# Altium project Lab 1 - Test.PrjPcb
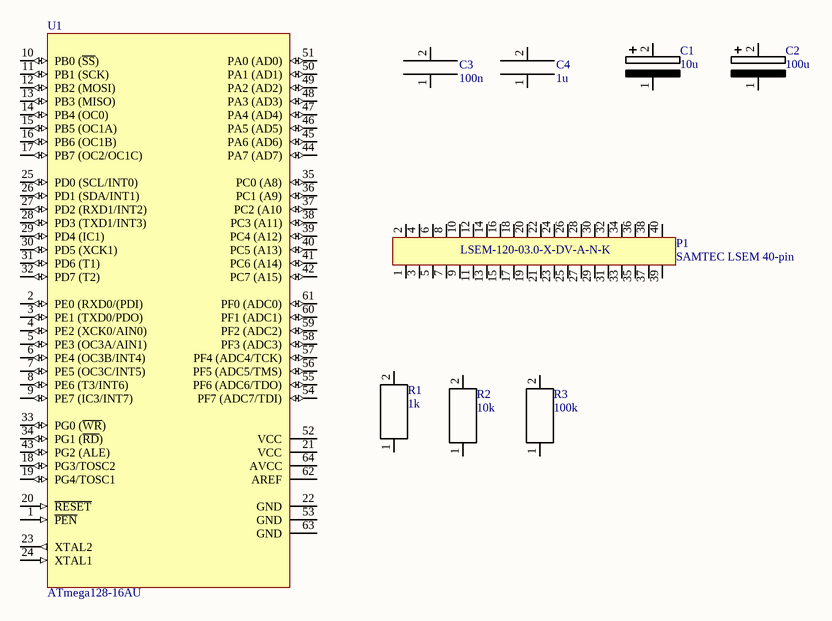
[diagram p0: Lab 1 - Test.SchDoc]
1 sheet, 9 parts. Net scope: global (net labels, ports and power ports of the same name join across sheets).
Board file: Lab 1 - Test.PcbDoc

## Sheet Lab 1 - Test.SchDoc
size A4; Author: Michał Wojna; CompanyName: AGH; Revision: 1; SheetNumber: 1; SheetTotal: 1

### Parts
C1  10u  [VJ_Tantalum_A]
C2  100u  [VJ_Tantalum_D]
C3  100n  [0805_IPC]
C4  1u  [0805_STD]
P1  SAMTEC LSEM 40-pin  [LSEM-120-03.0-L-DV-A-N-K-TR]
R1  1k  [0402]
R2  10k  [0603]
R3  100k  [1005]
U1  ATmega128-16AU  [64A_M]

### Nets

Not connected (* = marked no-connect by the designer): C1 1(PIN) 2(PIN); C2 1(PIN) 2(PIN); C3 1(PIN) 2(PIN); C4 1(PIN) 2(PIN); P1 1 2 3(2) 4(3) 5(3) 6(4) 7(4) 8(5) 9(5) 10(6) 11(6) 12(7) 13(7) 14(8) 15(8) 16(9) 17(9) 18(10) 19(10) 20(11) 21(11) 22(12) 23(12) 24(13) 25(13) 26(14) 27(14) 28(15) 29(15) 30(16) 31(16) 32(17) 33(17) 34(18) 35(18) 36(19) 37(19) 38(20) 39(20) 40(21); R1 1(PIN) 2(PIN); R2 1(PIN) 2(PIN); R3 1(PIN) 2(PIN); U1 1(~{PEN}) 2(PE0_(RXD0/(PDI)) 3(PE1_(TXD0/PDO)) 4(PE2_(XCK0/AIN0)) 5(PE3_(OC3A/AIN1)) 6(PE4_(OC3B/INT4)) 7(PE5_(OC3C/INT5)) 8(PE6_(T3/INT6)) 9(PE7_(IC3/INT7)) 10(PB0_(~{SS})) 11(PB1_(SCK)) 12(PB2_(MOSI)) 13(PB3_(MISO)) 14(PB4_(OC0)) 15(PB5_(OC1A)) 16(PB6_(OC1B)) 17(PB7_(OC2/OC1C)) 18(PG3/TOSC2) 19(PG4/TOSC1) 20(~{RESET}) 21(VCC) 22(GND) 23(XTAL2) 24(XTAL1) 25(PD0_(SCL/INT0)) 26(PD1_(SDA/INT1)) 27(PD2_(RXD1/INT2)) 28(PD3_(TXD1/INT3)) 29(PD4_(IC1)) 30(PD5_(XCK1)) 31(PD6_(T1)) 32(PD7_(T2)) 33(PG0_(~{WR})) 34(PG1_(~{RD})) 35(PC0_(A8)) 36(PC1_(A9)) 37(PC2_(A10) 38(PC3_(A11)) 39(PC4_(A12)) 40(PC5_(A13)) 41(PC6_(A14)) 42(PC7_(A15)) 43(PG2_(ALE)) 44(PA7_(AD7)) 45(PA6_(AD6)) 46(PA5_(AD5)) 47(PA4_(AD4)) 48(PA3_(AD3)) 49(PA2_(AD2)) 50(PA1_(AD1)) 51(PA0_(AD0)) 52(VCC) 53(GND) 54(PF7_(ADC7/TDI)) 55(PF6_(ADC6/TDO)) 56(PF5_(ADC5/TMS)) 57(PF4_(ADC4/TCK)) 58(PF3_(ADC3)) 59(PF2_(ADC2)) 60(PF1_(ADC1)) 61(PF0_(ADC0)) 62(AREF) 63(GND) 64(AVCC)

### Notes on the sheet
- Company Confidenrial / Not for distribution!
- Project name:
- Document Name:
- Designer Name:
- Date / Time:
- Revision:

### Library data of the parts
C1 C2 = Capacitor_polarized: Manufacturer: *; Part Number: *
  C1: Value: 10u
  C2: Value: 100u
C3 C4 = Capacitor: Manufacturer: *; Part Number: *
  C3: Value: 100n
  C4: Value: 1u
P1 = LSEM-120-03.0-X-DV-A-N-K: Manufacturer: SAMTEC; Part Number: LSEM-120-03.0-X-DV-A-N-K
R1-R3 = Resistor: Manufacturer: *; Part Number: *
  R1: Value: 1k
  R2: Value: 10k
  R3: Value: 100k
U1 = CMP-0095-00259-2: 8-bit AVR Microcontroller, 4.5-5.5V, 128KB Flash, 4KB EEPROM, 4KB SRAM, 64-pin TQFP, Industrial Grade (-40°C to 85°C); ComponentLink3URL: http://www.atmel.com/dyn/resources/prod_documents/2467S.pdf; PackageVersion: revC, Oct-2010; ComponentLink2URL: http://www.atmel.com/dyn/resources/prod_documents/doc2467.pdf; ComponentLink2Description: ATmega128(L) Datasheet; ComponentLink1Description: Manufacturer URL; PackageReference: 64A; DatasheetVersion: revX, Jun-2011; ComponentLink3Description: ATmega128(L) Summary; ComponentLink1URL: http://www.atmel.com/; RevisionNote: PackageVersion updated. URLs added.; Code_JEDEC: MS-026-AEB; PackageDescription: 64-Pin Plastic Thin Profile Quad Flat Pack, 14 x 14 x 1.0 mm Body, 0.8 mm Pitch (TQFP)